# Altium schematic sheet Sheet1.SchDoc
size A
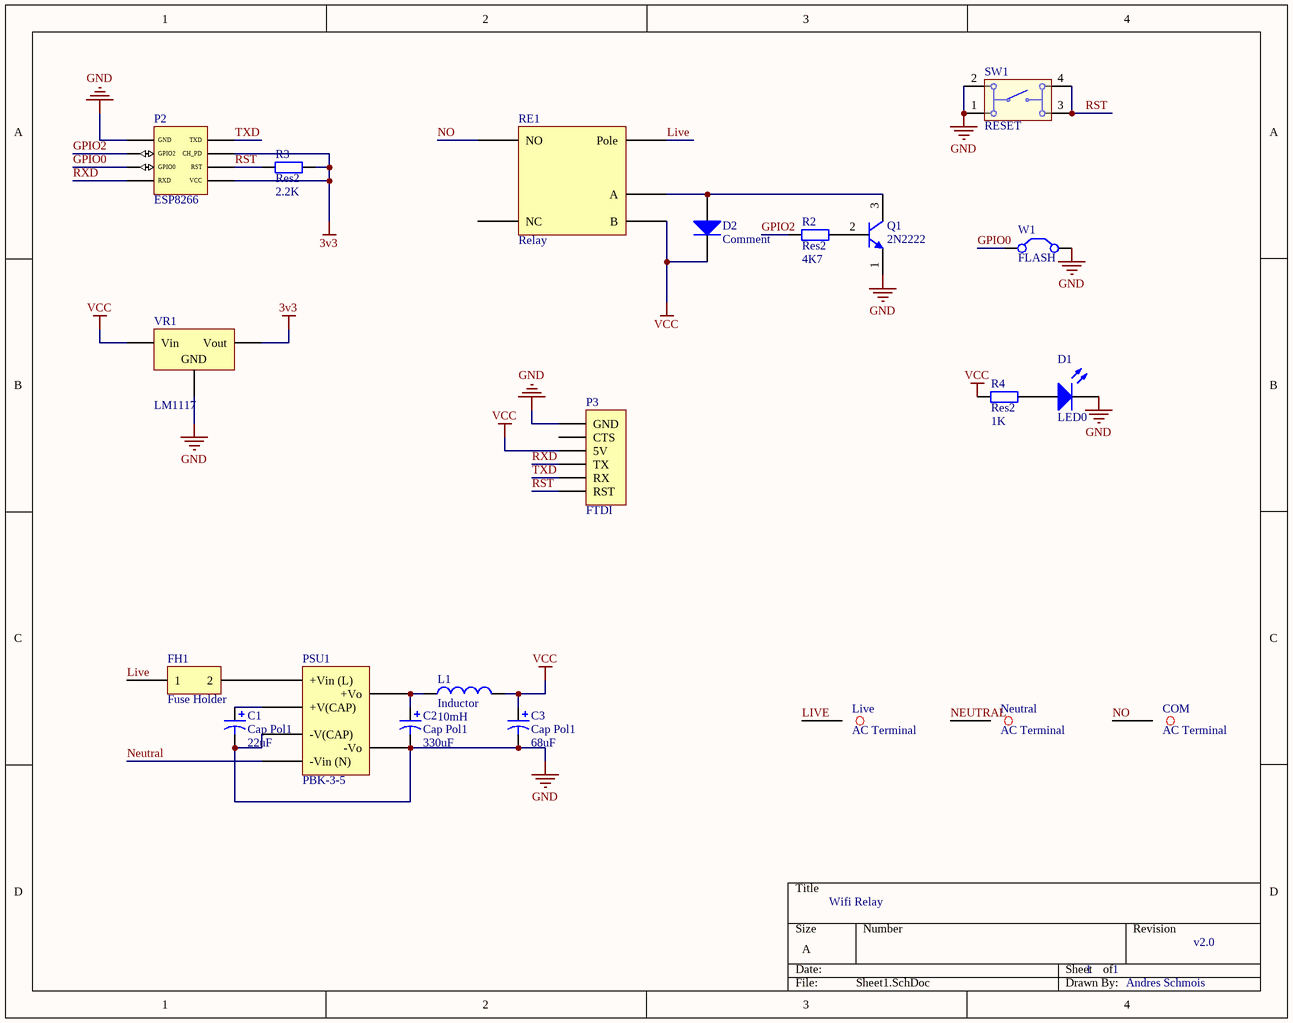
[diagram p0: Sheet1.SchDoc]

## Parts
C1  Cap Pol1  value 22uF  [CAPR5-4X5]
C2  Cap Pol1  value 330uF  [CAPR5-4X5]
C3  Cap Pol1  value 68uF  [CAPR5-4X5]
COM  AC Terminal  [AC Terminal]
D1  LED0  [LED-0]
D2  Comment  [DO-35]
FH1  Fuse Holder  [Fuse Holder]
L1  Inductor  value 10mH  [AXIAL-0.8]
Live  AC Terminal  [AC Terminal]
Neutral  AC Terminal  [AC Terminal]
P2  ESP8266  [ESP8266]
P3  FTDI  [HDR1X6]
PSU1  PBK-3-5  [PBK-3-5]
Q1  2N2222  [TO-92A]
R2  Res2  value 4K7  [AXIAL-0.4]
R3  Res2  value 2.2K  [AXIAL-0.4]
R4  Res2  value 1K  [AXIAL-0.4]
RE1  Relay  [Relay]
SW1  RESET  [430456085736]
VR1  LM1117  [TO-220-AB]
W1  FLASH  [RAD-0.2]

## Nets
3v3: P2.6(CH_PD) P2.8(VCC) R3.2 VR1.2(Vout)
GND: C1.2 C2.2 C3.2 D1.2(K) P2.1(GND) P3.1(GND) PSU1.7(-V(CAP)) PSU1.10(-Vo) Q1.1(E) SW1.1 SW1.2 VR1.1(GND) W1.2(C2)
VCC: C3.1 D2.2(K) L1.2 P3.3(5V) R4.1 RE1.2(B) VR1.3(Vin)
GPIO0: P2.3(GPIO0) W1.1(C1)
GPIO2: P2.2(GPIO2) R2.1
Live: FH1.1 Live.0 RE1.5(Pole)
Neutral: Neutral.0 PSU1.1(-Vin_(N))
NO: COM.0 RE1.4(NO)
RST: P2.7(RST) P3.6(RST) R3.1 SW1.3 SW1.4
RXD: P2.4(RXD) P3.4(TX)
TXD: P2.5(TXD) P3.5(RX)
NetC1_1: C1.1 PSU1.5(+V(CAP))
NetC2_1: C2.1 L1.1 PSU1.12(+Vo)
NetD1_1: D1.1(A) R4.2
NetD2_1: D2.1(A) Q1.3(C) RE1.1(A)
NetFH1_2: FH1.2 PSU1.3(+Vin_(L))
NetQ1_2: Q1.2(B) R2.2

Not connected (* = marked no-connect by the designer): P3 2(CTS); RE1 3(NC)

## Notes on the sheet
- Wifi Relay
- 1
- v2.0
- Andres Schmois

## Library data of the parts
C1-C3 = Cap Pol1: Polarized Capacitor (Radial); Published: 8-Jun-2000; LatestRevisionDate: 17-Jul-2002; LatestRevisionNote: Re-released for DXP Platform.; PackageReference: RB7.6-15; Publisher: Altium Limited; PackageDescription: Polarized Capacitor (Radial); 2 Leads
D1 = LED0: Typical INFRARED GaAs LED; Published: 8-Jun-2000; LatestRevisionDate: 08-Jul-2005; LatestRevisionNote: Mech Layer 1 removed.; PackageReference: LED-0; Publisher: Altium Limited; PackageDescription: LED; 2 Leads
D2 = Diode 1N914: High Conductance Fast Diode; Published: 8-Jun-2000; LatestRevisionDate: 17-Jul-2002; LatestRevisionNote: Re-released for DXP Platform.; DatasheetVersion: 1997; PackageReference: DO-35; Publisher: Altium Limited; PackageDescription: Diode, Axial; Body 3.8 x 1.9 mm (LxDia. max), Lead Dia. 0.53 mm (max); Code_JEDEC: DO-204-AH; ComponentLink1Description: Manufacturer Link; ComponentLink1URL: http://www.fairchildsemi.com/; ComponentLink2Description: Datasheet; ComponentLink2URL: http://www.fairchildsemi.com/ds/1N%2F1N4448.pdf
L1 = Inductor: Code_IEC: 1005; Published: 8-Jun-2000; LatestRevisionDate: 29-May-2009; LatestRevisionNote: IPC-7351 Footprint Added.; PackageReference: 0402-A; Publisher: Altium Limited; PackageDescription: Chip Inductor; Code_JEITA: 0402
P2 = Header 4X2A: Header, 4-Pin, Dual row; LatestRevisionDate: 17-Jul-2002; LatestRevisionNote: Re-released for DXP Platform.; Publisher: Altium Limited
P3 = Header 6: Header, 6-Pin; LatestRevisionDate: 17-Jul-2002; LatestRevisionNote: Re-released for DXP Platform.; Publisher: Altium Limited
PSU1 = PBK-3-5: 120Vac to 5Vdc psu
Q1 = 2N3904: NPN General Purpose Amplifier; Published: 8-Jun-2000; LatestRevisionDate: 15-Jan-2003; LatestRevisionNote: PCB Footprint 'BCY-W3/D4.7' replaced; DatasheetVersion: 1997; PackageVersion: Sep-1998; PackageReference: TO-92A; Publisher: Altium Limited; PackageDescription: TO, Flat Index; 3 In-Line, Axial Leads; Body Dia. 4.5mm; Leads 0.51 x 0.48 mm (max); ComponentLink1Description: Manufacturer Link; ComponentLink1URL: http://www.fairchildsemi.com/; ComponentLink2Description: Datasheet; ComponentLink2URL: http://www.fairchildsemi.com/ds/2N%2F2N3904.pdf
R2-R4 = Res2: Resistor; Published: 8-Jun-2000; LatestRevisionDate: 17-Jul-2002; LatestRevisionNote: Re-released for DXP Platform.; PackageReference: AXIAL-0.4; Publisher: Altium Limited; PackageDescription: Axial Device, Thru-Hole; 2 Leads; 0.4 in Pin Spacing
SW1 = WE-Tact Switches WS-TATV 430456085736: WS-TATV THT Tact Switch 12X12 mm; Manufacturer: W¨¹rth Elektronik eiSos GmbH & Co.KG; ComponentLink1 Description: Manufacturer; ComponentLink2 Description: Datasheet; Creat by: Karrer Zheng; NoPins: 04; Creat Date: 28 February 2014; partNo: 430456085736; ComponentLink1URL: http://www.we-online.com; ComponentLink2URL: http://katalog.we-online.de/em/datasheet/430456085736.pdf
VR1 = Volt Reg: Voltage Regulator; Published: 24-Mar-1999; LatestRevisionDate: 29-May-2009; LatestRevisionNote: IPC-7351 Footprint Added.; PackageReference: D2PAK; Publisher: Altium Limited; PackageDescription: 3-Pin Transistor Outline Package 2.54 mm Pitch, 15.1 mm Lead Span
W1 = Jumper: Jumper Wire; Published: 24-Mar-1999; LatestRevisionDate: 17-Jul-2002; LatestRevisionNote: Re-released for DXP Platform.; PackageReference: RAD-0.2; Publisher: Altium Limited; PackageDescription: Radial Cap, Thru-Hole; 2 Leads; 0.2 in Pin Spacing